# Altium project Bott_Back.PrjPcb
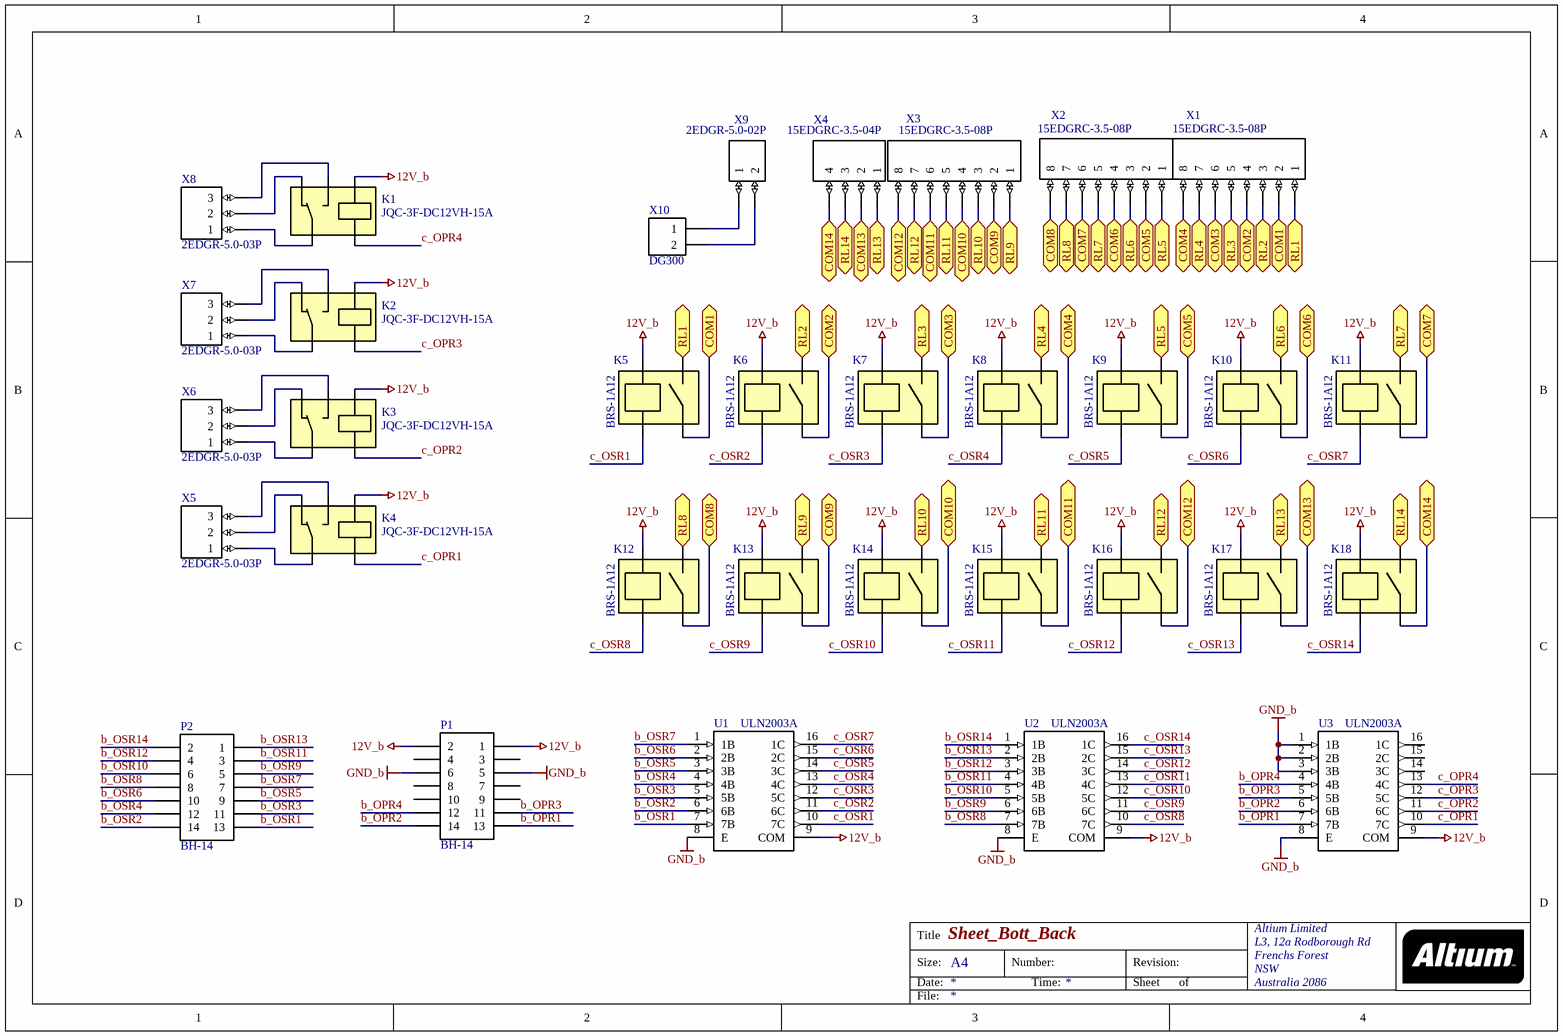
[diagram p0: Sheet_Bott_Back.SchDoc]
1 sheet, 33 parts. Net scope: flat (ports and power ports of the same name join across sheets).
Board file: PCB_monitoring_Bott_Back.PcbDoc

## Sheet Sheet_Bott_Back.SchDoc: Sheet_Bott_Back
size A4; Organization: Altium Limited; Address1: L3, 12a Rodborough Rd; Address2: Frenchs Forest; Address3: NSW; Address4: Australia 2086

### Parts
K1  JQC-3F-DC12VH-15A  [BS-115C-12A]
K2  JQC-3F-DC12VH-15A  [BS-115C-12A]
K3  JQC-3F-DC12VH-15A  [BS-115C-12A]
K4  JQC-3F-DC12VH-15A  [BS-115C-12A]
K5  BRS-1A12  [R_BRS]
K6  BRS-1A12  [R_BRS]
K7  BRS-1A12  [R_BRS]
K8  BRS-1A12  [R_BRS]
K9  BRS-1A12  [R_BRS]
K10  BRS-1A12  [R_BRS]
K11  BRS-1A12  [R_BRS]
K12  BRS-1A12  [R_BRS]
K13  BRS-1A12  [R_BRS]
K14  BRS-1A12  [R_BRS]
K15  BRS-1A12  [R_BRS]
K16  BRS-1A12  [R_BRS]
K17  BRS-1A12  [R_BRS]
K18  BRS-1A12  [R_BRS]
P1  BH-14  [BH-14]
P2  BH-14  [BH-14]
U1  ULN2003A  [SO-16_N]
U2  ULN2003A  [SO-16_N]
U3  ULN2003A  [SO-16_N]
X1  15EDGRC-3.5-08P  [MC_3.5_8]
X2  15EDGRC-3.5-08P  [MC_3.5_8]
X3  15EDGRC-3.5-08P  [MC_3.5_8]
X4  15EDGRC-3.5-04P  [MC_3.5_4]
X5  2EDGR-5.0-03P  [2EDGR-5.0-03P]
X6  2EDGR-5.0-03P  [2EDGR-5.0-03P]
X7  2EDGR-5.0-03P  [2EDGR-5.0-03P]
X8  2EDGR-5.0-03P  [2EDGR-5.0-03P]
X9  2EDGR-5.0-02P  [2EDGR-5.0-02P]
X10  DG300  [5mm 2]

### Ports
COM1, COM2, COM3, COM4, COM5, COM6, COM7, COM8, COM9, COM10, COM11, COM12, COM13, COM14, RL1, RL2, RL3, RL4, RL5, RL6, RL7, RL8, RL9, RL10, RL11, RL12, RL13, RL14

### Nets
12V_b: K1.1 K2.1 K3.1 K4.1 K5.3 K6.3 K7.3 K8.3 K9.3 K10.3 K11.3 K12.3 K13.3 K14.3 K15.3 K16.3 K17.3 K18.3 P1.1 P1.2 U1.9(COM) U2.9(COM) U3.9(COM)
GND_b: P1.5 P1.6 U1.8(E) U2.8(E) U3.1(1B) U3.2(2B) U3.3(3B) U3.8(E)
b_OPR1: P1.13 U3.7(7B)
b_OPR2: P1.14 U3.6(6B)
b_OPR3: P1.11 U3.5(5B)
b_OPR4: P1.12 U3.4(4B)
b_OSR1: P2.13 U1.7(7B)
b_OSR2: P2.14 U1.6(6B)
b_OSR3: P2.11 U1.5(5B)
b_OSR4: P2.12 U1.4(4B)
b_OSR5: P2.9 U1.3(3B)
b_OSR6: P2.10 U1.2(2B)
b_OSR7: P2.7 U1.1(1B)
b_OSR8: P2.8 U2.7(7B)
b_OSR9: P2.5 U2.6(6B)
b_OSR10: P2.6 U2.5(5B)
b_OSR11: P2.3 U2.4(4B)
b_OSR12: P2.4 U2.3(3B)
b_OSR13: P2.1 U2.2(2B)
b_OSR14: P2.2 U2.1(1B)
c_OPR1: K4.2 U3.10(7C)
c_OPR2: K3.2 U3.11(6C)
c_OPR3: K2.2 U3.12(5C)
c_OPR4: K1.2 U3.13(4C)
c_OSR1: K5.5 U1.10(7C)
c_OSR2: K6.5 U1.11(6C)
c_OSR3: K7.5 U1.12(5C)
c_OSR4: K8.5 U1.13(4C)
c_OSR5: K9.5 U1.14(3C)
c_OSR6: K10.5 U1.15(2C)
c_OSR7: K11.5 U1.16(1C)
c_OSR8: K12.5 U2.10(7C)
c_OSR9: K13.5 U2.11(6C)
c_OSR10: K14.5 U2.12(5C)
c_OSR11: K15.5 U2.13(4C)
c_OSR12: K16.5 U2.14(3C)
c_OSR13: K17.5 U2.15(2C)
c_OSR14: K18.5 U2.16(1C)
NetK1_3: K1.3 X8.1
NetK1_4: K1.4 X8.2
NetK1_5: K1.5 X8.3
NetK2_3: K2.3 X7.1
NetK2_4: K2.4 X7.2
NetK2_5: K2.5 X7.3
NetK3_3: K3.3 X6.1
NetK3_4: K3.4 X6.2
NetK3_5: K3.5 X6.3
NetK4_3: K4.3 X5.1
NetK4_4: K4.4 X5.2
NetK4_5: K4.5 X5.3
NetK5_1: K5.1 X1.1 ; port RL1
NetK5_7: K5.7 X1.2 ; port COM1
NetK6_1: K6.1 X1.3 ; port RL2
NetK6_7: K6.7 X1.4 ; port COM2
NetK7_1: K7.1 X1.5 ; port RL3
NetK7_7: K7.7 X1.6 ; port COM3
NetK8_1: K8.1 X1.7 ; port RL4
NetK8_7: K8.7 X1.8 ; port COM4
NetK9_1: K9.1 X2.1 ; port RL5
NetK9_7: K9.7 X2.2 ; port COM5
NetK10_1: K10.1 X2.3 ; port RL6
NetK10_7: K10.7 X2.4 ; port COM6
NetK11_1: K11.1 X2.5 ; port RL7
NetK11_7: K11.7 X2.6 ; port COM7
NetK12_1: K12.1 X2.7 ; port RL8
NetK12_7: K12.7 X2.8 ; port COM8
NetK13_1: K13.1 X3.1 ; port RL9
NetK13_7: K13.7 X3.2 ; port COM9
NetK14_1: K14.1 X3.3 ; port RL10
NetK14_7: K14.7 X3.4 ; port COM10
NetK15_1: K15.1 X3.5 ; port RL11
NetK15_7: K15.7 X3.6 ; port COM11
NetK16_1: K16.1 X3.7 ; port RL12
NetK16_7: K16.7 X3.8 ; port COM12
NetK17_1: K17.1 X4.1 ; port RL13
NetK17_7: K17.7 X4.2 ; port COM13
NetK18_1: K18.1 X4.3 ; port RL14
NetK18_7: K18.7 X4.4 ; port COM14
NetX9_1: X9.1 X10.1
NetX9_2: X9.2 X10.2

Not connected (* = marked no-connect by the designer): P1 3 4 7 8 9 10; U3 14(3C) 15(2C) 16(1C)

### Notes on the sheet
- Title
- Size:
- Date:
- A4
- Number:
- Time:
- Revision:
- Sheet
- of
- File:

### Library data of the parts
K1-K4 = JQC-3F-DC12VH-7A: 7A 240Vac 1 pole Slim relay
K5-K18 = BRS-1A12: 1A, 10Vdc, 1 pole, SIP terminal
P1 P2 = BH-14: IDC/BH; LatestRevisionDate: 17-Jul-2002; LatestRevisionNote: Re-released for DXP Platform.; Publisher: Altium Limited
U1-U3 = ULN2003A: Darlington Transistor Arrays
X1-X3 = MC_3.5_8: Connector 3.5mm
X4 = MC_3.5_4: Connector 3.5mm
X5-X8 = 2EDGR-5.0-03P: Connector 5mm
X9 = 2EDGR-5.0-02P: Connector 5mm
X10 = DG300_2pin: Connector 5mm